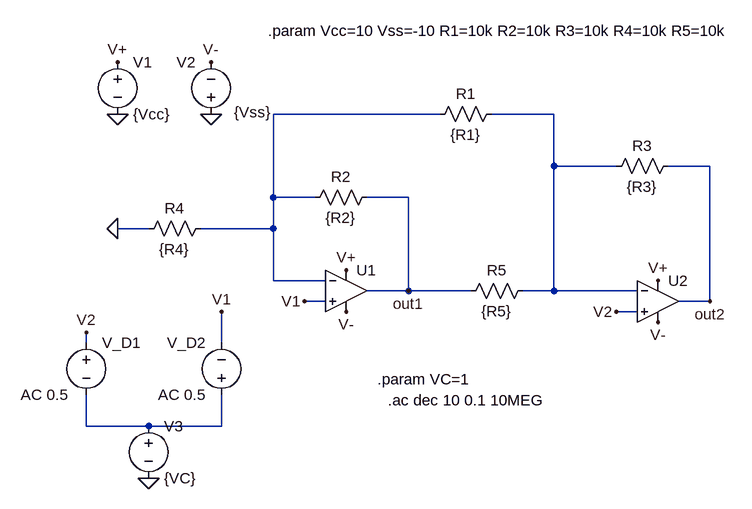
[diagram p0: schematic LAB1_AC.asc]
LAB1_AC.asc, the LTspice schematic file:
Version 4
SHEET 1 880 680
WIRE 224 -96 -32 -96
WIRE 400 -96 304 -96
WIRE 400 -16 400 -96
WIRE 496 -16 400 -16
WIRE 640 -16 576 -16
WIRE -32 32 -32 -96
WIRE 32 32 -32 32
WIRE 176 32 112 32
WIRE -224 80 -272 80
WIRE -32 80 -32 32
WIRE -32 80 -144 80
WIRE -32 160 -32 80
WIRE 48 160 -32 160
WIRE 176 176 176 32
WIRE 176 176 112 176
WIRE 272 176 176 176
WIRE 400 176 400 -16
WIRE 400 176 352 176
WIRE 528 176 400 176
WIRE 48 192 16 192
WIRE 640 192 640 -16
WIRE 640 192 592 192
WIRE 528 208 496 208
WIRE -320 256 -320 240
WIRE -112 256 -112 208
WIRE -320 384 -320 336
WIRE -224 384 -320 384
WIRE -112 384 -112 336
WIRE -112 384 -224 384
FLAG -272 80 0
FLAG 640 192 out2
FLAG 176 176 out1
FLAG 496 208 V2
FLAG 16 192 V1
FLAG -128 -96 0
FLAG -272 -96 0
FLAG -272 -176 V+
FLAG 80 144 V+
FLAG 560 160 V+
FLAG -128 -176 V-
FLAG 80 208 V-
FLAG 560 224 V-
FLAG -320 240 V2
FLAG -112 208 V1
FLAG -224 464 0
SYMBOL res 320 -112 R90
WINDOW 0 0 56 VBottom 2
WINDOW 3 32 56 VTop 2
SYMATTR InstName R1
SYMATTR Value {R1}
SYMBOL res 128 16 R90
WINDOW 0 0 56 VBottom 2
WINDOW 3 32 56 VTop 2
SYMATTR InstName R2
SYMATTR Value {R2}
SYMBOL res 592 -32 R90
WINDOW 0 0 56 VBottom 2
WINDOW 3 32 56 VTop 2
SYMATTR InstName R3
SYMATTR Value {R3}
SYMBOL res -128 64 R90
WINDOW 0 0 56 VBottom 2
WINDOW 3 32 56 VTop 2
SYMATTR InstName R4
SYMATTR Value {R4}
SYMBOL res 368 160 R90
WINDOW 0 0 56 VBottom 2
WINDOW 3 32 56 VTop 2
SYMATTR InstName R5
SYMATTR Value {R5}
SYMBOL OpAmps\\UniversalOpamp2 80 176 R0
SYMATTR InstName U1
SYMATTR SpiceModel level.1
SYMATTR SpiceLine2 ""
SYMBOL OpAmps\\UniversalOpamp2 560 192 R0
SYMATTR InstName U2
SYMATTR SpiceModel level.1
SYMATTR SpiceLine ""
SYMATTR SpiceLine2 ""
SYMBOL voltage -272 -192 R0
SYMATTR InstName V1
SYMATTR Value {Vcc}
SYMBOL voltage -128 -80 R180
WINDOW 0 24 96 Left 2
WINDOW 3 -92 19 Left 2
SYMATTR InstName V2
SYMATTR Value {Vss}
SYMBOL voltage -320 240 R0
WINDOW 3 -101 96 Left 2
SYMATTR InstName V_D1
SYMATTR Value AC 0.5
SYMBOL voltage -112 352 R180
WINDOW 0 24 96 Left 2
WINDOW 3 24 16 Left 2
WINDOW 123 0 0 Left 0
WINDOW 39 0 0 Left 0
SYMATTR InstName V_D2
SYMATTR Value AC 0.5
SYMBOL voltage -224 368 R0
WINDOW 123 0 0 Left 0
WINDOW 39 0 0 Left 0
SYMATTR InstName V3
SYMATTR Value {VC}
TEXT -40 -224 Left 2 !.param Vcc=10 Vss=-10 R1=10k R2=10k R3=10k R4=10k R5=10k
TEXT 128 312 Left 2 !.param VC=1
TEXT 144 344 Left 2 !.ac dec 10 0.1 10MEG

The netlist it stands for:
* LAB1_AC.asc
R1 N002 N001 {R1}
R2 out1 N001 {R2}
R3 out2 N002 {R3}
R4 N001 0 {R4}
R5 N002 out1 {R5}
XU1 V1 N001 V+ V- out1 level.1 Avol=1Meg GBW=10Meg Slew=10Meg ilimit=25m rail=0 Vos=0 phimargin=45  ; pins IN+ IN- V+ V- OUT
XU2 V2 N002 V+ V- out2 level.1 Avol=1Meg GBW=10Meg Slew=10Meg  ; pins IN+ IN- V+ V- OUT
V1 V+ 0 {Vcc}
V2 0 V- {Vss}
V_D1 V2 N003 AC 0.5
V_D2 N003 V1 AC 0.5
V3 N003 0 {VC}
.param Vcc=10 Vss=-10 R1=10k R2=10k R3=10k R4=10k R5=10k
.param VC=1
.ac dec 10 0.1 10MEG
.lib UniversalOpamps2.sub
.backanno
.end